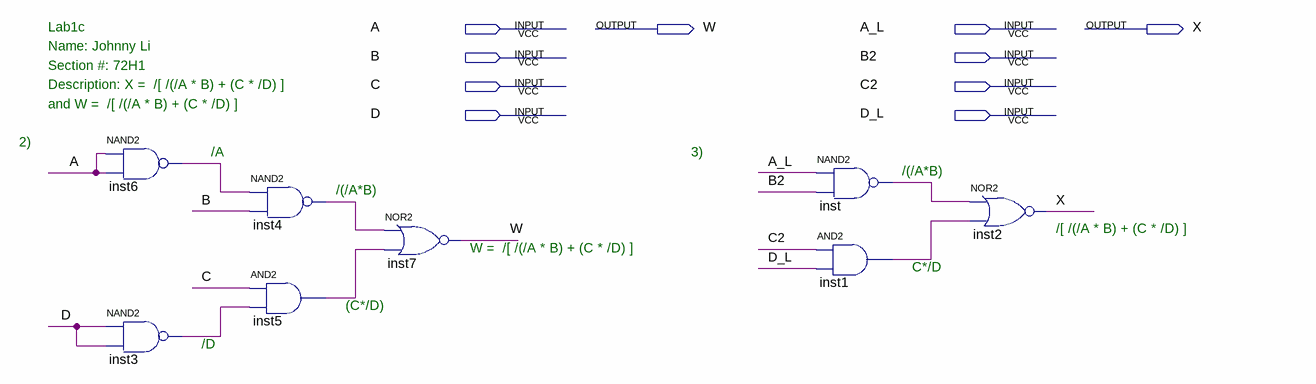
[diagram p0: schematic sheet]
// Quartus schematic lab1c.bdf as structural Verilog: 8 symbols, 10 pins
module lab1c (
  input  A,
  input  A_L,
  input  B,
  input  B2,
  input  C,
  input  C2,
  input  D,
  input  D_L,
  output W,
  output X
);

  wire inst1_out, inst3_out, inst4_out, inst5_out, inst6_out, inst_out;

  nand inst6 (inst6_out, A, A);
  nand inst3 (inst3_out, D, D);
  nand inst4 (inst4_out, inst6_out, B);
  and inst5 (inst5_out, C, inst3_out);
  nor inst7 (W, inst4_out, inst5_out);
  nand inst (inst_out, A_L, B2);
  and inst1 (inst1_out, C2, D_L);
  nor inst2 (X, inst_out, inst1_out);

  // Notes on the sheet:
  //   Lab1c
  //   Name: Johnny Li
  //   Section #: 72H1
  //   Description: X =  /[ /(/A * B) + (C * /D) ]
  //   and W =  /[ /(/A * B) + (C * /D) ]
  //   2)
  //   /A
  //   3)
  //   /(/A*B)
  //   /(/A*B)
  //   /[ /(/A * B) + (C * /D) ]
  //   W =  /[ /(/A * B) + (C * /D) ]
  //   C*/D
  //   (C*/D)
  //   /D
endmodule
